# Altium project Current_Controller.PrjPcb
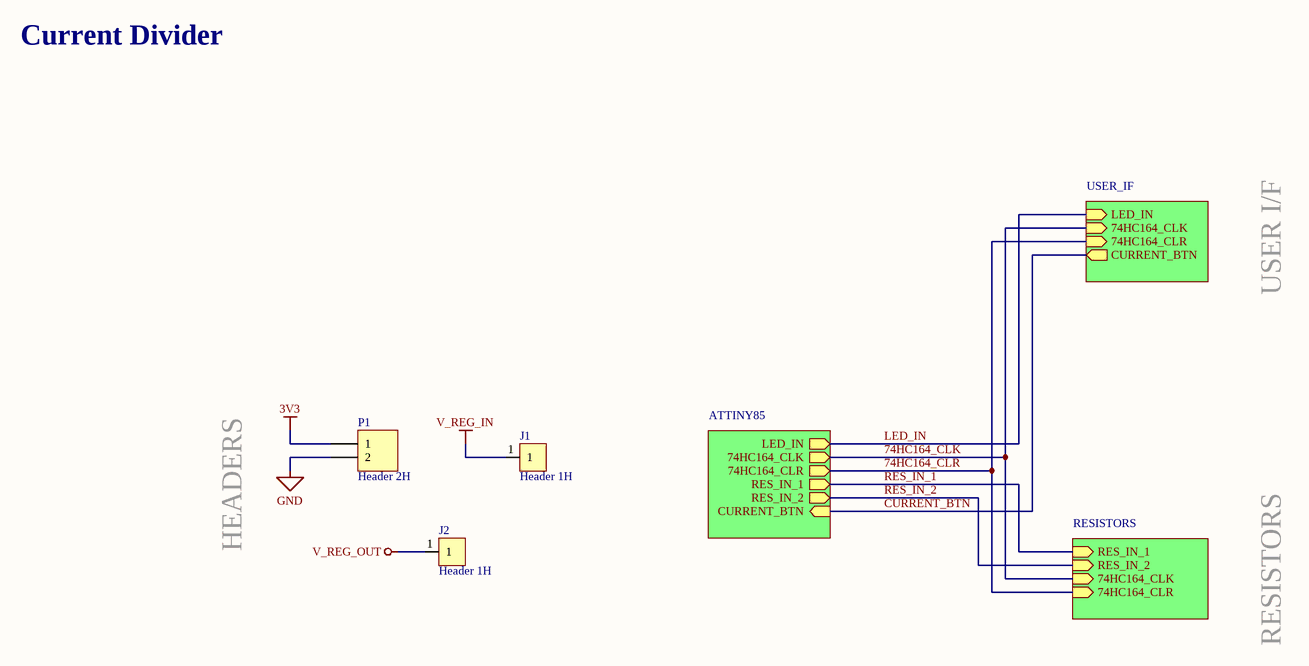
[diagram p0: CurrentDivider.SchDoc]
Author: Arib Hussain; Title: Current Divider; Revision: 1.1
4 sheets, 34 parts. Net scope: hierarchical (ports join the sheet entries above them; power ports are global).
Sheets:
  CurrentDivider.SchDoc
    USER_IF = USER_IF.SchDoc
    ATTINY85 = ATTINY85.SchDoc
    RESISTORS = RESISTORS.SchDoc

## Sheet CurrentDivider.SchDoc: Current Divider
size A4; SheetNumber: 1; SheetTotal: 4

### Parts
J1  Header 1H
J2  Header 1H
P1  Header 2H  [HDR1X2H]

### Sub-sheets
ATTINY85 = ATTINY85.SchDoc: LED_IN (out), 74HC164_CLK (out), 74HC164_CLR (out), RES_IN_1 (out), RES_IN_2 (out), CURRENT_BTN (in)
RESISTORS = RESISTORS.SchDoc: RES_IN_1 (in), 74HC164_CLK (in), 74HC164_CLR (in), RES_IN_2 (in)
USER_IF = USER_IF.SchDoc: LED_IN (in), 74HC164_CLK (in), 74HC164_CLR (in), CURRENT_BTN (out)

### Nets
3V3: P1.1
GND: P1.2
V_REG_IN: J1.1
V_REG_OUT: J2.1
74HC164_CLK: sheet USER_IF/74HC164_CLK, sheet ATTINY85/74HC164_CLK, sheet RESISTORS/74HC164_CLK
74HC164_CLR: sheet USER_IF/74HC164_CLR, sheet ATTINY85/74HC164_CLR, sheet RESISTORS/74HC164_CLR
CURRENT_BTN: sheet USER_IF/CURRENT_BTN, sheet ATTINY85/CURRENT_BTN
LED_IN: sheet USER_IF/LED_IN, sheet ATTINY85/LED_IN
RES_IN_1: sheet ATTINY85/RES_IN_1, sheet RESISTORS/RES_IN_1
RES_IN_2: sheet ATTINY85/RES_IN_2, sheet RESISTORS/RES_IN_2

### Notes on the sheet
- Current Divider
- USER I/F
- HEADERS
- RESISTORS

### Library data of the parts
J1 J2 = Header, 1-Pin
P1 = Header 2H: Header, 2-Pin, Right Angle; LatestRevisionDate: 17-Jul-2002; LatestRevisionNote: Re-released for DXP Platform.; Publisher: Altium Limited

## Sheet USER_IF.SchDoc: Current Divider
size A4; SheetNumber: 2; SheetTotal: 4
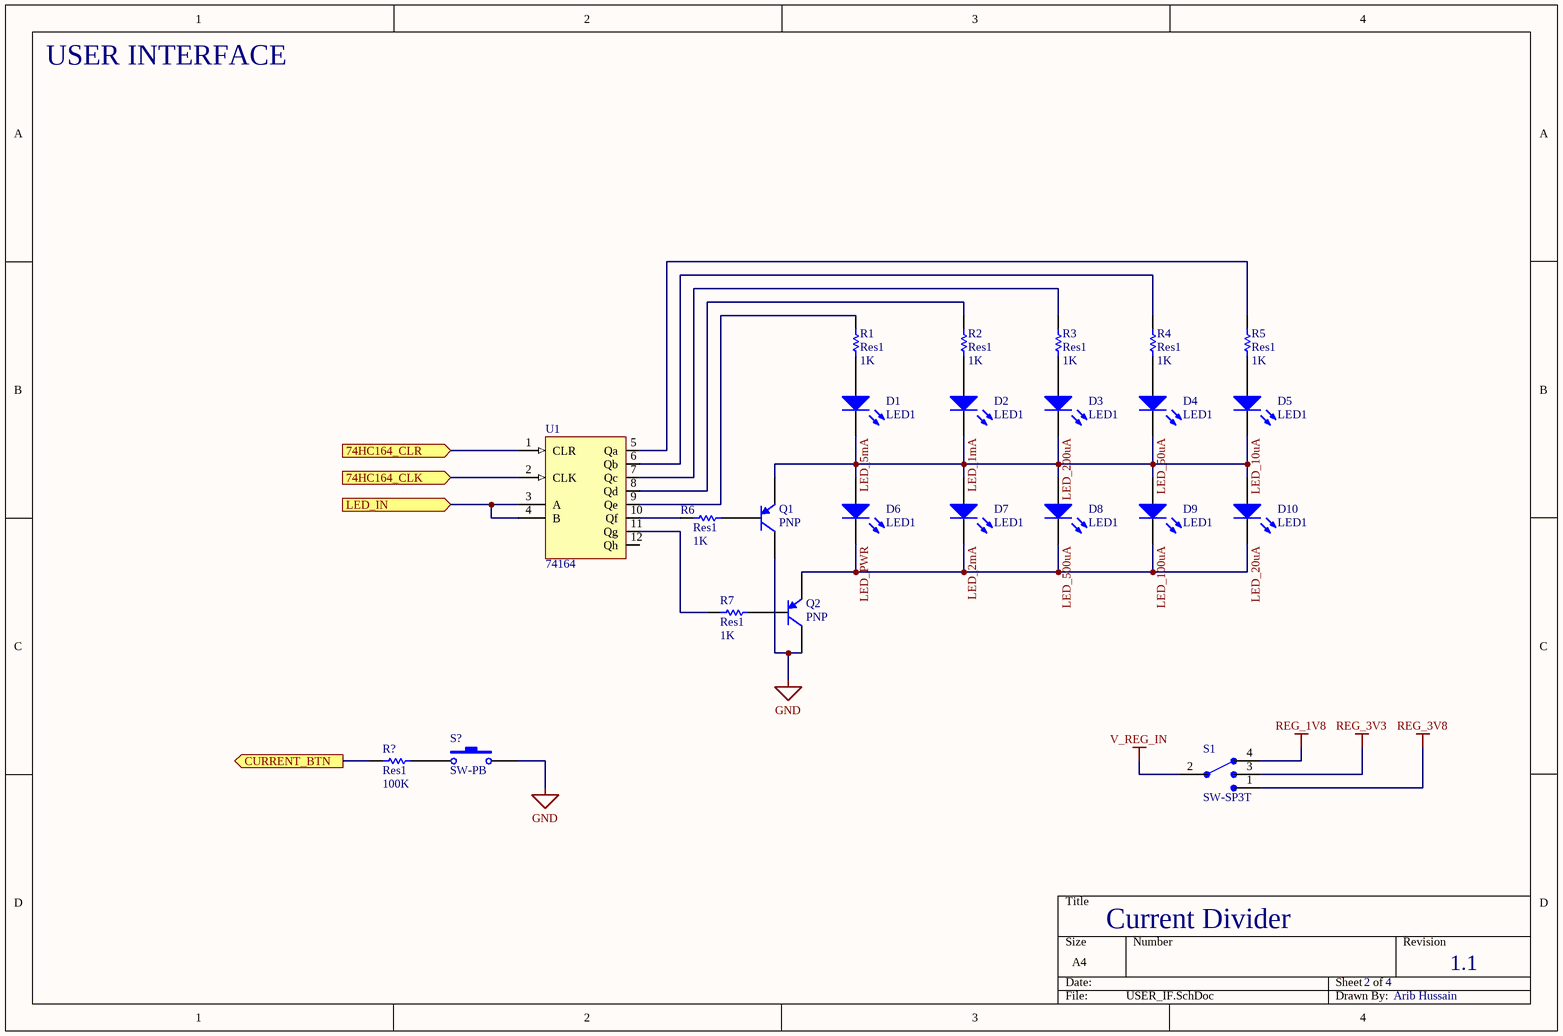
[diagram p1: USER_IF.SchDoc]

### Parts
D1  LED1  [LED-1]
D2  LED1  [LED-1]
D3  LED1  [LED-1]
D4  LED1  [LED-1]
D5  LED1  [LED-1]
D6  LED1  [LED-1]
D7  LED1  [LED-1]
D8  LED1  [LED-1]
D9  LED1  [LED-1]
D10  LED1  [LED-1]
Q1  PNP  [SOT-23B_N]
Q2  PNP  [SOT-23B_N]
R1  Res1  value 1K  [AXIAL-0.3]
R2  Res1  value 1K  [AXIAL-0.3]
R3  Res1  value 1K  [AXIAL-0.3]
R4  Res1  value 1K  [AXIAL-0.3]
R5  Res1  value 1K  [AXIAL-0.3]
R6  Res1  value 1K  [AXIAL-0.3]
R7  Res1  value 1K  [AXIAL-0.3]
R?  Res1  value 100K  [AXIAL-0.3]
S1  SW-SP3T  [SW_PCM13SMTR]
S?  SW-PB  [SPST-2]
U1  74164

### Ports
74HC164_CLK (in), 74HC164_CLR (in), CURRENT_BTN (out), LED_IN (in)

### Nets
GND: Q1.1(C) Q2.1(C) S?.2
REG_1V8: S1.4
REG_3V3: S1.3
REG_3V8: S1.1
V_REG_IN: S1.2
74HC164_CLK: U1.2(CLK) ; port 74HC164_CLK
74HC164_CLR: U1.1(CLR) ; port 74HC164_CLR
CURRENT_BTN: R?.1 ; port CURRENT_BTN
LED_10uA: D1.2(K) D2.2(K) D3.2(K) D4.2(K) D5.2(K) D6.1(A) D7.1(A) D8.1(A) D9.1(A) D10.1(A) Q1.3(E)  [also labelled LED_1mA, LED_200uA, LED_50uA, LED_5mA]
LED_100uA: D6.2(K) D7.2(K) D8.2(K) D9.2(K) D10.2(K) Q2.3(E)  [also labelled LED_20uA, LED_2mA, LED_500uA, LED_PWR]
LED_IN: U1.3(A) U1.4(B) ; port LED_IN
NetD1_1: D1.1(A) R1.1
NetD2_1: D2.1(A) R2.1
NetD3_1: D3.1(A) R3.1
NetD4_1: D4.1(A) R4.1
NetD5_1: D5.1(A) R5.1
NetQ1_2: Q1.2(B) R6.2
NetQ2_2: Q2.2(B) R7.2
NetR1_2: R1.2 U1.9(Qe)
NetR2_2: R2.2 U1.8(Qd)
NetR3_2: R3.2 U1.7(Qc)
NetR4_2: R4.2 U1.6(Qb)
NetR5_2: R5.2 U1.5(Qa)
NetR6_1: R6.1 U1.10(Qf)
NetR7_1: R7.1 U1.11(Qg)
NetR?_2: R?.2 S?.1

Not connected (* = marked no-connect by the designer): U1 12(Qh)

### Notes on the sheet
- USER INTERFACE

### Library data of the parts
D1-D10 = LED1: Typical RED GaAs LED; Published: 8-Jun-2000; LatestRevisionDate: 08-Jul-2005; LatestRevisionNote: Mech Layer 1 removed.; PackageReference: LED-1; Publisher: Altium Limited; PackageDescription: LED; 2 Leads
Q1 Q2 = PNP: PNP Bipolar Transistor; Published: 8-Jun-2000; LatestRevisionDate: 29-May-2009; LatestRevisionNote: IPC-7351 Footprint Added.; PackageVersion: Aug-1999; PackageReference: SOT-23B; Publisher: Altium Limited; PackageDescription: 3-Pin SOT-23 Package 0.95 mm Pitch, 2.4 mm Lead Span
R1-R7 R? = Res1: Resistor; Published: 8-Jun-2000; LatestRevisionDate: 17-Jul-2002; LatestRevisionNote: Re-released for DXP Platform.; PackageReference: AXIAL-0.3; Publisher: Altium Limited; PackageDescription: Axial Device, Thru-Hole; 2 Leads; 0.3 in Pin Spacing
S1 = SP3T: SP3T Subminiature Toggle Switch, Right Angle Mounting, Vertical Actuation; MP: PCM13SMTR; MF: C&K; Value: *; SnapEDA_Link: https://www.snapeda.com/parts/PCM13SMTR/C%26K/view-part/392684/?ref=snap; Availability: Unavailable; Package: None; Price: None
S? = SW-PB: Switch; Published: 24-Mar-1999; LatestRevisionDate: 17-Jul-2002; LatestRevisionNote: Re-released for DXP Platform.; PackageReference: SPST-2; Publisher: Altium Limited; PackageDescription: Switch; 2 Leads
U1 = 74HC164: 8-Bit Shift Register

## Sheet ATTINY85.SchDoc: Current Divider
size A4; SheetNumber: 3; SheetTotal: 4
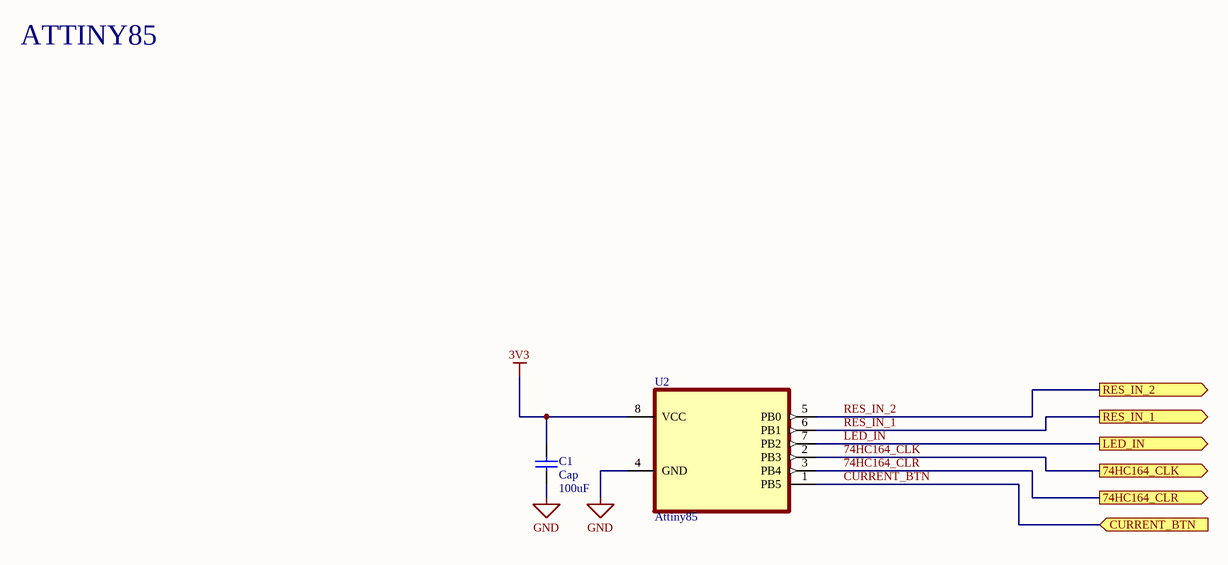
[diagram p2: ATTINY85.SchDoc]

### Parts
C1  Cap  value 100uF  [RAD-0.3]
U2  Attiny85  [SOIC127P798X216-8N]

### Ports
74HC164_CLK (out), 74HC164_CLR (out), CURRENT_BTN (in), LED_IN (out), RES_IN_1 (out), RES_IN_2 (out)

### Nets
3V3: C1.2 U2.8(VCC)
GND: C1.1 U2.4(GND)
74HC164_CLK: U2.2(PB3) ; port 74HC164_CLK
74HC164_CLR: U2.3(PB4) ; port 74HC164_CLR
CURRENT_BTN: U2.1(PB5) ; port CURRENT_BTN
LED_IN: U2.7(PB2) ; port LED_IN
RES_IN_1: U2.6(PB1) ; port RES_IN_1
RES_IN_2: U2.5(PB0) ; port RES_IN_2

### Notes on the sheet
- ATTINY85

### Library data of the parts
C1 = Cap: Capacitor; Published: 8-Jun-2000; LatestRevisionDate: 17-Jul-2002; LatestRevisionNote: Re-released for DXP Platform.; PackageReference: RAD-0.3; Publisher: Altium Limited; PackageDescription: Radial Cap, Thru-Hole; 2 Leads; 0.3 in Pin Spacing
U2 = ATTINY85-20SH: AVR ATtiny Microcontroller IC 8-Bit 20MHz 8KB _4K x 16_ FLASH 8-SOIC; MF: Microchip; Availability: Unavailable; MP: ATTINY85-20SH; SnapEDA_Link: https://www.snapeda.com/parts/ATTINY85-20SH/Microchip/view-part/641442/?ref=snap; Value: *; Price: None; Package: SOIC-8 Microchip

## Sheet RESISTORS.SchDoc: Current Divider
size A4; SheetNumber: 4; SheetTotal: 4
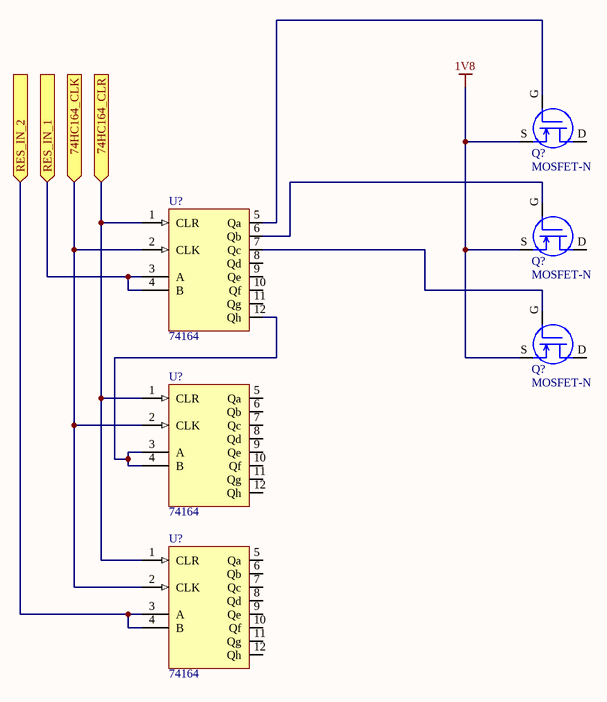
[diagram p3: RESISTORS.SchDoc]

### Parts
(Parts that share a designator on the sheet are numbered #1, #2 ... from top to bottom, then left to right.)
Q?#1  MOSFET-N
Q?#2  MOSFET-N
Q?#3  MOSFET-N
U?#1  74164
U?#2  74164
U?#3  74164

### Ports
74HC164_CLK (in), 74HC164_CLR (in), RES_IN_1 (in), RES_IN_2 (in)

### Nets
1V8: Q?#1.S Q?#2.S Q?#3.S
74HC164_CLK: U?#1.2(CLK) U?#2.2(CLK) U?#3.2(CLK) ; port 74HC164_CLK
74HC164_CLR: U?#1.1(CLR) U?#2.1(CLR) U?#3.1(CLR) ; port 74HC164_CLR
RES_IN_1: U?#1.3(A) U?#1.4(B) ; port RES_IN_1
RES_IN_2: U?#3.3(A) U?#3.4(B) ; port RES_IN_2
NetQ?#1_G: Q?#1.G U?#1.5(Qa)
NetQ?#2_G: Q?#2.G U?#1.6(Qb)
NetQ?#3_G: Q?#3.G U?#1.7(Qc)
NetU?#1_12: U?#1.12(Qh) U?#2.3(A) U?#2.4(B)

Not connected (* = marked no-connect by the designer): Q?#1 D; Q?#2 D; Q?#3 D; U?#1 8(Qd) 9(Qe) 10(Qf) 11(Qg); U?#2 5(Qa) 6(Qb) 7(Qc) 8(Qd) 9(Qe) 10(Qf) 11(Qg) 12(Qh); U?#3 5(Qa) 6(Qb) 7(Qc) 8(Qd) 9(Qe) 10(Qf) 11(Qg) 12(Qh)

### Library data of the parts
Q?#1-Q?#3 = N-Channel MOSFET: Misc. N-Channel MOSFET schematic symbol.
U?#1-U?#3 = 74HC164: 8-Bit Shift Register

## Nets that join several sheets
3V3: CurrentDivider (P1.1), ATTINY85 (C1.2 U2.8)
GND: CurrentDivider (P1.2), USER_IF (Q1.1 Q2.1 S?.2), ATTINY85 (C1.1 U2.4)
V_REG_IN: CurrentDivider (J1.1), USER_IF (S1.2)
74HC164_CLK: USER_IF (U1.2), ATTINY85 (U2.2), RESISTORS (U?#1.2 U?#2.2 U?#3.2)
74HC164_CLR: USER_IF (U1.1), ATTINY85 (U2.3), RESISTORS (U?#1.1 U?#2.1 U?#3.1)
CURRENT_BTN: USER_IF (R?.1), ATTINY85 (U2.1)
LED_IN: USER_IF (U1.3 U1.4), ATTINY85 (U2.7)
RES_IN_1: ATTINY85 (U2.6), RESISTORS (U?#1.3 U?#1.4)
RES_IN_2: ATTINY85 (U2.5), RESISTORS (U?#3.3 U?#3.4)